# EAGLE design light_up_board (EAGLE 6.6.0)
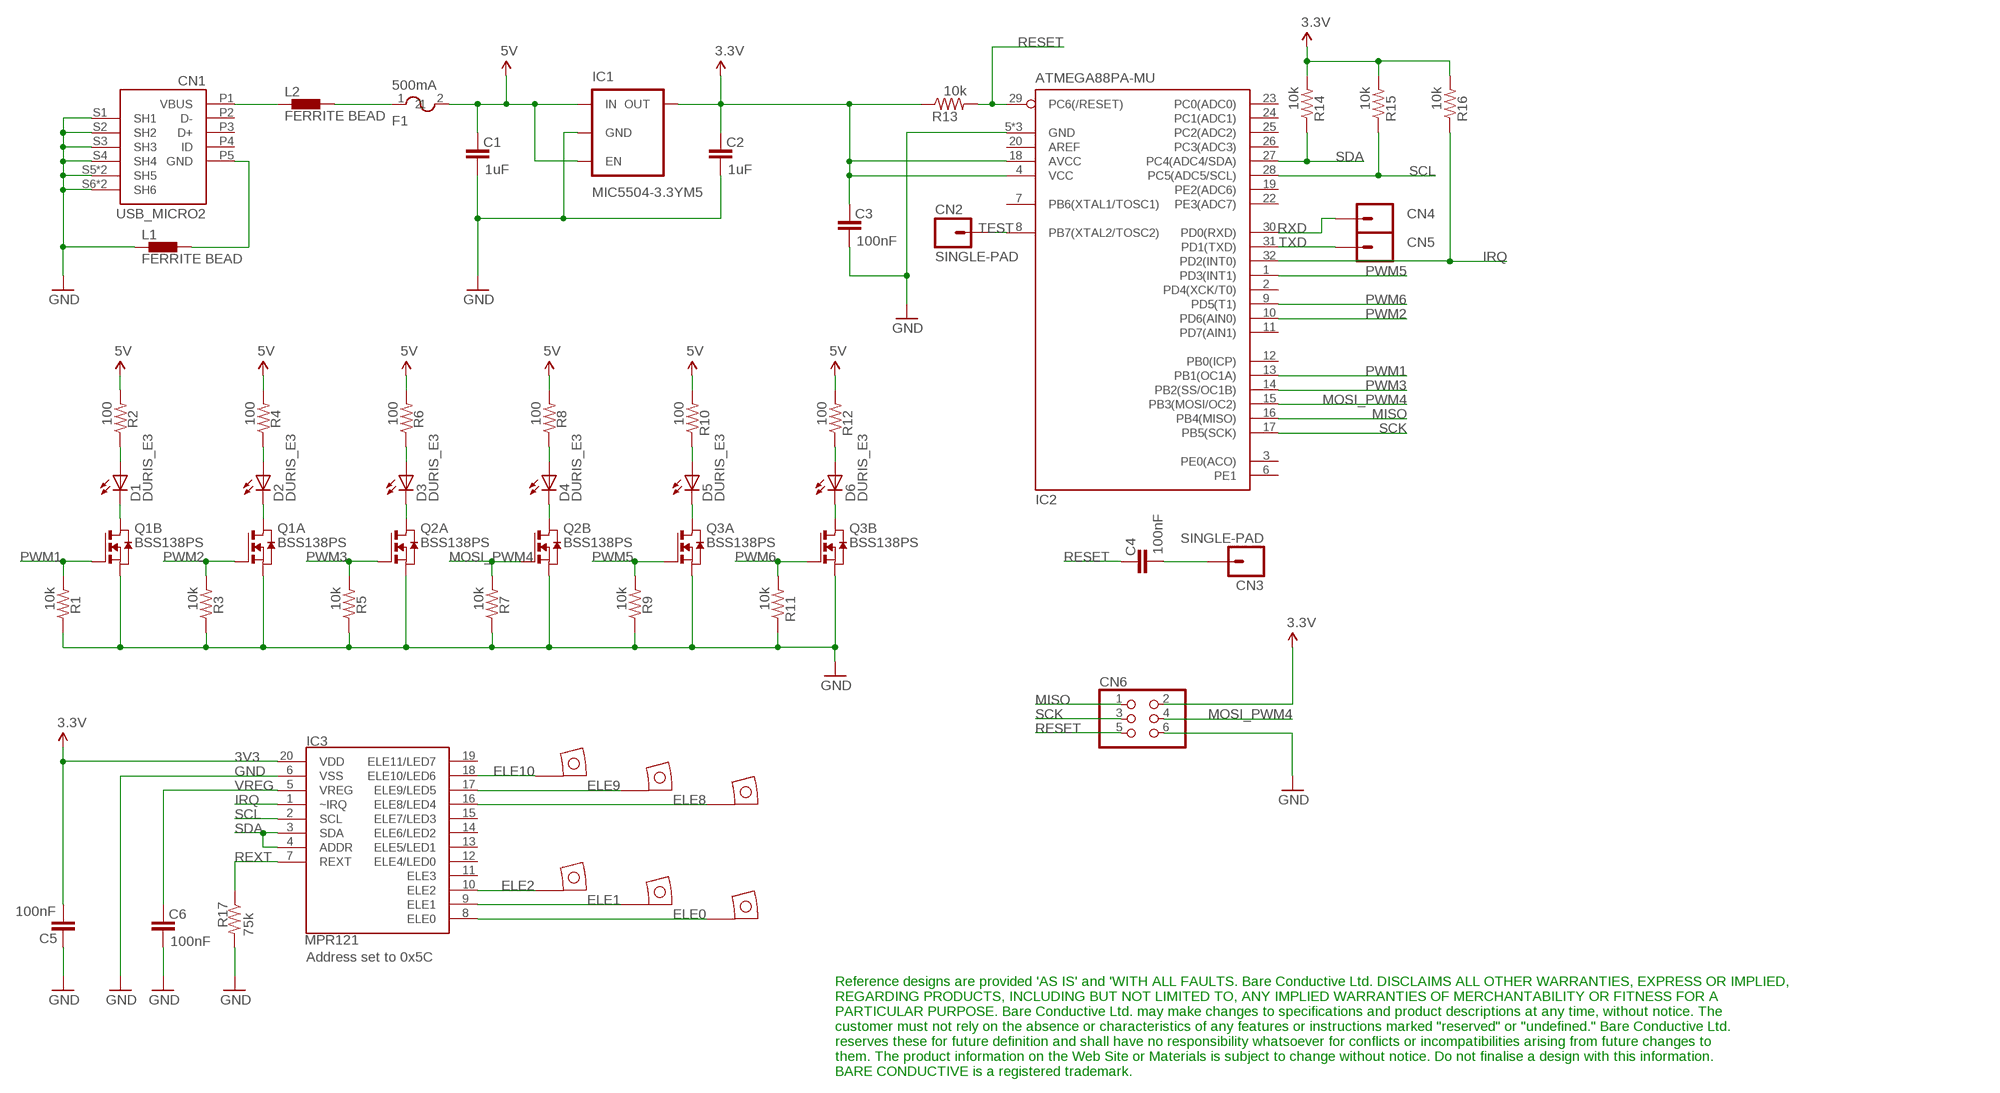
[diagram p0: schematic, sheet 1]

## Parts
C1  1uF  CAP0402-CAP  [0402-CAP]
C2  1uF  CAP0402-CAP  [0402-CAP]
C3  100nF  CAP0402-CAP  [0402-CAP]
C4  100nF  CAP0402-CAP  [0402-CAP]
C5  100nF  CAP0402-CAP  [0402-CAP]
C6  100nF  CAP0402-CAP  [0402-CAP]
CN1  USB_MICRO2  [USB_MICRO_B_SCK_2_TANGS]
CN2  SINGLE-PAD  [1MM_0.4MM_DRILL_PAD]
CN3  SINGLE-PAD  [1MM_0.4MM_DRILL_PAD]
CN4  SINGLE-PAD  [1MM_0.4MM_DRILL_PAD]
CN5  SINGLE-PAD  [1MM_0.4MM_DRILL_PAD]
CN6  ICSP  PINHD-2X3SQ1_1.27_0.4_DRILL  [2X03_1.27_SQ1_0.4_DRILL]
D1  DURIS_E3  [PLCC2_3X1.4]
D2  DURIS_E3  [PLCC2_3X1.4]
D3  DURIS_E3  [PLCC2_3X1.4]
D4  DURIS_E3  [PLCC2_3X1.4]
D5  DURIS_E3  [PLCC2_3X1.4]
D6  DURIS_E3  [PLCC2_3X1.4]
F1  500mA  PTC  [MF-PSMF050X-2]
IC1  MIC5504-3.3YM5  V_REG_LDOSMD  [SOT23-5]
IC2  ATMEGA88PA-MU  MEGAX8PBMU/MEDPADS  [HVQFN32-MEDPADS]
IC3  MPR121  MPR121QR2/LONGPADS-NORESIST  [QFN-20-0.4MM-LONGPADS-NORESIST]
L1  FERRITE BEAD  BLM15HB121SN1  [0402]
L2  FERRITE BEAD  BLM15HB121SN1  [0402]
Q1  BSS138PS  [SOT363_PHILIPS]
Q2  BSS138PS  [SOT363_PHILIPS]
Q3  BSS138PS  [SOT363_PHILIPS]
R1  10k  RESISTOR0402-RES  [0402-RES]
R2  100  RESISTOR0402-RES  [0402-RES]
R3  10k  RESISTOR0402-RES  [0402-RES]
R4  100  RESISTOR0402-RES  [0402-RES]
R5  10k  RESISTOR0402-RES  [0402-RES]
R6  100  RESISTOR0402-RES  [0402-RES]
R7  10k  RESISTOR0402-RES  [0402-RES]
R8  100  RESISTOR0402-RES  [0402-RES]
R9  10k  RESISTOR0402-RES  [0402-RES]
R10  100  RESISTOR0402-RES  [0402-RES]
R11  10k  RESISTOR0402-RES  [0402-RES]
R12  100  RESISTOR0402-RES  [0402-RES]
R13  10k  RESISTOR0402-RES  [0402-RES]
R14  10k  RESISTOR0402-RES  [0402-RES]
R15  10k  RESISTOR0402-RES  [0402-RES]
R16  10k  RESISTOR0402-RES  [0402-RES]
R17  75k  RESISTOR0402-RES  [0402-RES]
U$1  EPSK-ELEC_2.0  [EPSK_ELEC_2.0]
U$2  EPSK-ELEC_2.0  [EPSK_ELEC_2.0]
U$3  EPSK-ELEC_2.0  [EPSK_ELEC_2.0]
U$4  EPSK-ELEC_2.0  [EPSK_ELEC_2.0]
U$5  EPSK-ELEC_2.0  [EPSK_ELEC_2.0]
U$6  EPSK-ELEC_2.0  [EPSK_ELEC_2.0]

## Nets
3V3: C2.2 C3.2 C5.1 CN6.2 IC1.5(OUT) IC2.4(VCC) IC2.18(AVCC) IC3.20(VDD) R13.1 R14.2 R15.2 R16.2 ; supply symbol labelled 3.3V
5V: C1.2 F1.2 IC1.1(IN) IC1.3(EN) R2.2 R4.2 R6.2 R8.2 R10.2 R12.2
ELE0: IC3.8(ELE0) U$6.1
ELE1: IC3.9(ELE1) U$4.1
ELE2: IC3.10(ELE2) U$2.1
ELE8: IC3.16(ELE8/LED4) U$5.1
ELE9: IC3.17(ELE9/LED5) U$3.1
ELE10: IC3.18(ELE10/LED6) U$1.1
GND: C1.1 C2.1 C3.1 C5.2 C6.1 CN1.S1(SH1) CN1.S2(SH2) CN1.S3(SH3) CN1.S4(SH4) CN1.S5(SH5) CN1.S6(SH6) CN1.S7(SH5) CN1.S8(SH6) CN6.6 IC1.2(GND) IC2.5(GND) IC2.21(GND) IC2.EXP(GND) IC3.6(VSS) L1.1 Q1.1(A:S) Q1.4(B:S) Q2.1(A:S) Q2.4(B:S) Q3.1(A:S) Q3.4(B:S) R1.1 R3.1 R5.1 R7.1 R9.1 R11.1 R17.2
IRQ: IC2.32(PD2(INT0)) IC3.1(~IRQ) R16.1
MISO: CN6.1 IC2.16(PB4(MISO))
MOSI_PWM4: CN6.4 IC2.15(PB3(MOSI/OC2)) Q2.5(B:G) R7.2
N$1: D4.A R8.1
N$2: CN1.P1(VBUS) L2.1
N$3: D1.K(C) Q1.3(B:D)
N$4: CN1.P5(GND) L1.2
N$5: F1.1 L2.2
N$6: C4.1 CN3.1
N$7: D1.A R2.1
N$8: D5.A R10.1
N$9: D6.A R12.1
N$10: D2.K(C) Q1.6(A:D)
N$11: D2.A R4.1
N$12: D3.A R6.1
N$13: D3.K(C) Q2.6(A:D)
N$14: D4.K(C) Q2.3(B:D)
N$15: D5.K(C) Q3.6(A:D)
N$16: D6.K(C) Q3.3(B:D)
PWM1: IC2.13(PB1(OC1A)) Q1.5(B:G) R1.2
PWM2: IC2.10(PD6(AIN0)) Q1.2(A:G) R3.2
PWM3: IC2.14(PB2(SS/OC1B)) Q2.2(A:G) R5.2
PWM5: IC2.1(PD3(INT1)) Q3.2(A:G) R9.2
PWM6: IC2.9(PD5(T1)) Q3.5(B:G) R11.2
RESET: C4.2 CN6.5 IC2.29(PC6(/RESET)) R13.2
REXT: IC3.7(REXT) R17.1
RXD: CN4.1 IC2.30(PD0(RXD))
SCK: CN6.3 IC2.17(PB5(SCK))
SCL: IC2.28(PC5(ADC5/SCL)) IC3.2(SCL) R15.1
SDA: IC2.27(PC4(ADC4/SDA)) IC3.3(SDA) IC3.4(ADDR) R14.1
TEST: CN2.1 IC2.8(PB7(XTAL2/TOSC2))
TXD: CN5.1 IC2.31(PD1(TXD))
VREG: C6.2 IC3.5(VREG)
Unconnected: CN1.P2(D-) CN1.P3(D+) CN1.P4(ID) IC2.2(PD4(XCK/T0)) IC2.3(PE0(ACO)) IC2.6(PE1) IC2.7(PB6(XTAL1/TOSC1)) IC2.11(PD7(AIN1)) IC2.12(PB0(ICP)) IC2.19(PE2(ADC6)) IC2.20(AREF) IC2.22(PE3(ADC7)) IC2.23(PC0(ADC0)) IC2.24(PC1(ADC1)) IC2.25(PC2(ADC2)) IC2.26(PC3(ADC3)) IC3.11(ELE3) IC3.12(ELE4/LED0) IC3.13(ELE5/LED1) IC3.14(ELE6/LED2) IC3.15(ELE7/LED3) IC3.19(ELE11/LED7)

## Notes on the sheet
- Address set to 0x5C
- Reference designs are provided 'AS IS' and 'WITH ALL FAULTS. Bare Conductive Ltd. DISCLAIMS ALL OTHER WARRANTIES, EXPRESS OR IMPLIED,
  REGARDING PRODUCTS, INCLUDING BUT NOT LIMITED TO, ANY IMPLIED WARRANTIES OF MERCHANTABILITY OR FITNESS FOR A 
  PARTICULAR PURPOSE. Bare Conductive Ltd. may make changes to specifications and product descriptions at any time, without notice. The 
  customer must not rely on the absence or characteristics of any features or instructions marked "reserved" or "undefined." Bare Conductive Ltd.
  reserves these for future definition and shall have no responsibility whatsoever for conflicts or incompatibilities arising from future changes to 
  them. The product information on the Web Site or Materials is subject to change without notice. Do not finalise a design with this information.
  BARE CONDUCTIVE is a registered trademark.

## Library data of the parts
C1-C6 = SparkFun:CAP: Capacitor Standard 0603 ceramic capacitor, and 0.1" leaded capacitor.
CN1 = BC-Connectors:USB_MICRO
CN2-CN5 = BC-Connectors:SINGLE-PAD
CN6 = BC-Connectors:PINHD-2X3: PIN HEADER
D1-D6 = BC-LED:DURIS_E3
F1 = BareConductive:PTC: PTC FUSE 0805
IC1 = BC-AnalogIC:V_REG_LDO: Voltage Regulator LDO Standard 300mA LDO voltage regulator in SOT-23 layout. Microchip (Micrel) part MIC5501/2/3/4.
IC2 = BC-DigitalIC:MEGAX8PB: MICROCONTROLLER 8 Kbytes FLASH, 1 kbytes SRAM, 512 bytes EEPROM, USART, 6-channel 10 bit ADC, 2-channel 8 bit ADC Pin compatible with Atmega48PB, ATMega88PB, ATMega168PB, ATMega328PB
IC3 = BC-Sensors:MPR121QR2
L1 L2 = inductors:BLM15H: EMIFIL (R) Chip Ferrite Bead for GHz Noise Source: http://www.murata.com/ Ferrite Bead BLM15H.pdf
Q1-Q3 = BC-DiscreteSemi:BSS138PS: Dual MOS FET
R1-R17 = SparkFun:RESISTOR: Resistor Basic schematic elements and footprints for 0603, 1206, and PTH resistors.
U$1-U$6 = BC-Connectors:EPSK-ELEC

## Net classes
2 gnd: width 0.2 mm, drill 0.5 mm, clearance 0.2 mm
3 usbvcc: width 0.2 mm, drill 0.5 mm, clearance 0.2 mm

## Board
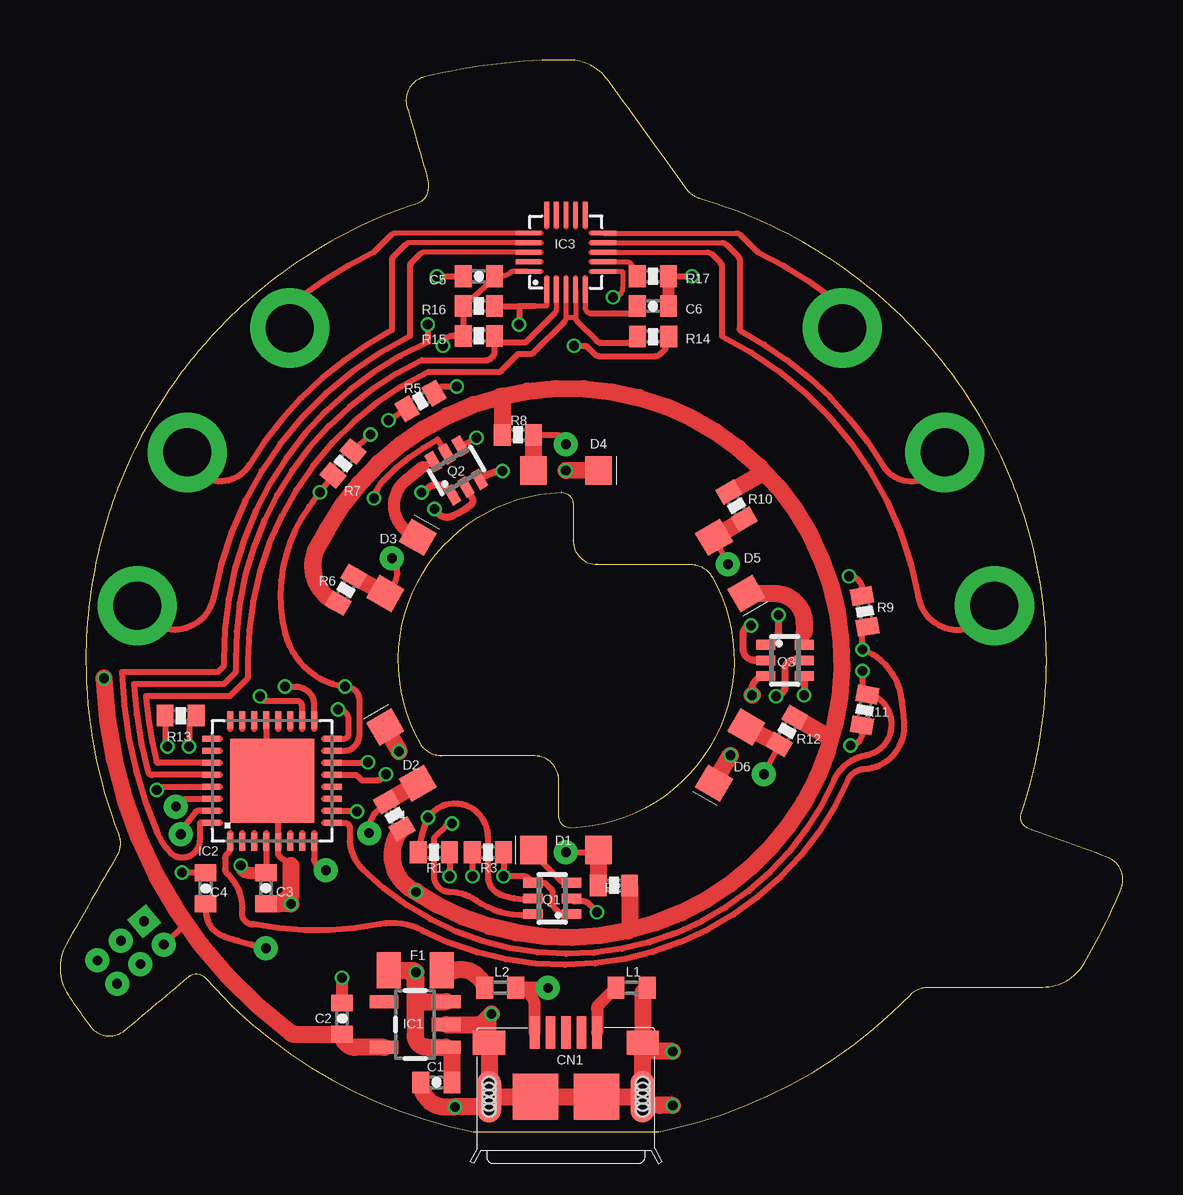
[diagram p1: board, top side]
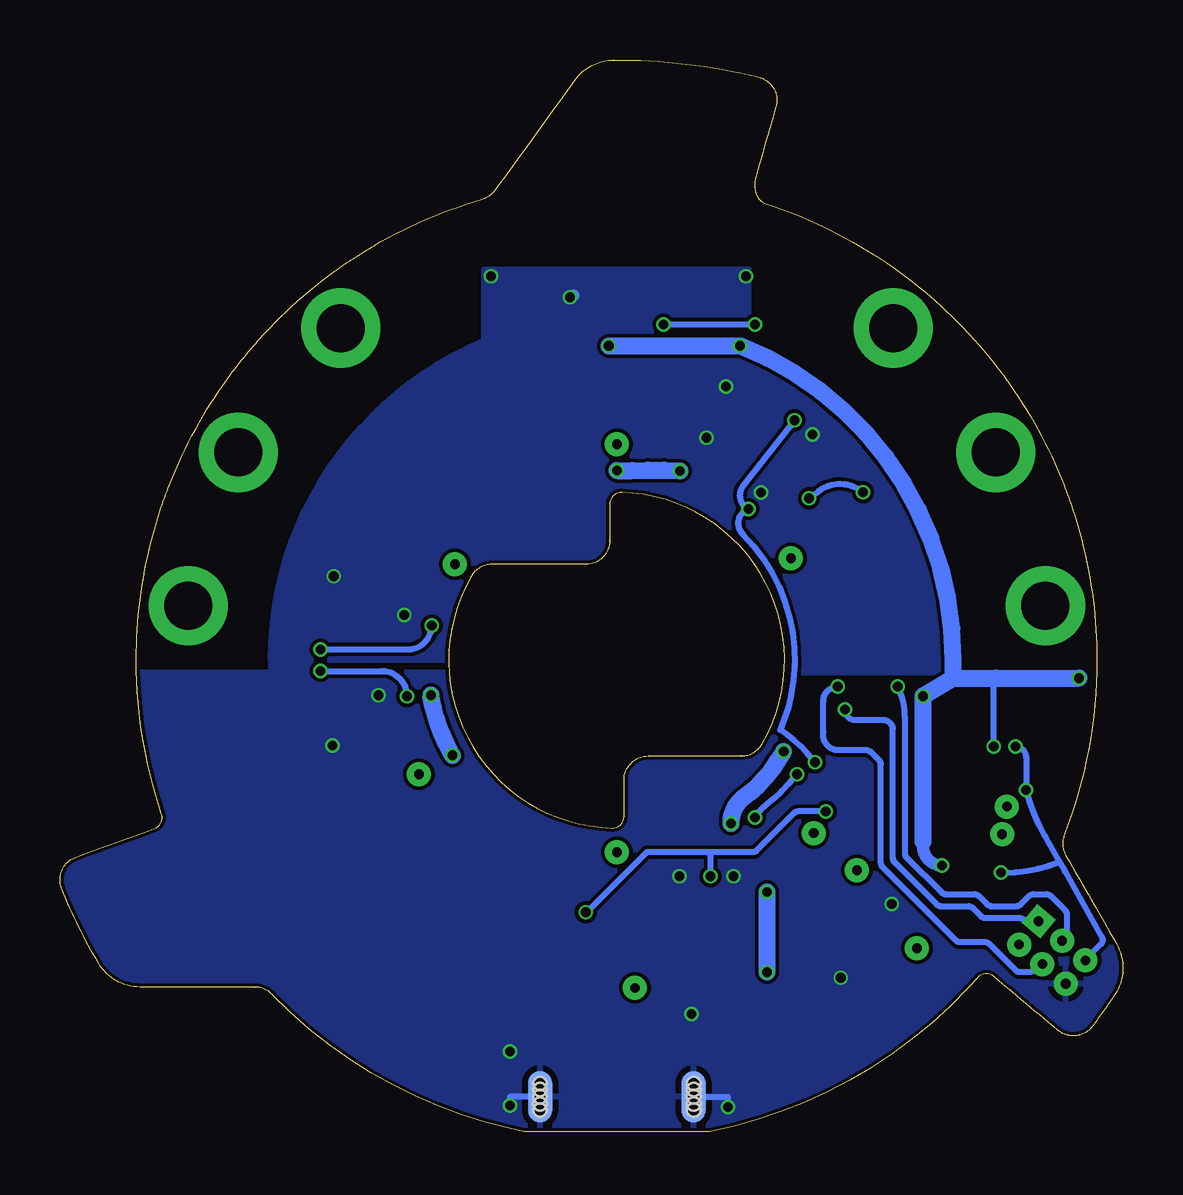
[diagram p2: board, bottom side, seen from below]

Size 44.28 x 44.65 mm. Coordinates in mm from the lower left corner, seen from the top.
Outline: 15.9,15.65 19.78,15.65 19.88,15.64 19.98,15.63 20.08,15.6 20.17,15.57 20.26,15.53 20.34,15.48 20.42,15.42 20.49,15.35 20.56,15.28 20.61,15.2 20.66,15.12 20.71,15.03 20.74,14.94 20.76,14.85 20.78,14.75 20.78,14.64 20.78,13.14 20.78,13.14 20.79,13.04 20.82,12.95 20.87,12.86 20.93,12.79 21,12.73 21.09,12.68 21.18,12.65 21.28,12.64 21.74,12.67 22.2,12.73 22.66,12.82 23.11,12.94 23.55,13.09 23.98,13.26 24.39,13.47 24.79,13.7 25.17,13.96 25.54,14.24 25.89,14.55 26.22,14.88 26.53,15.23 26.81,15.61 27.07,16.01 27.3,16.42 27.51,16.85 27.68,17.28 27.82,17.73 27.93,18.18 28.02,18.64 28.07,19.09 28.09,19.56 28.08,20.02 28.04,20.48 27.97,20.94 27.86,21.39 27.73,21.84 27.57,22.28 27.38,22.71 27.15,23.13 27.16,23.12 27.12,23.18 27.09,23.24 27.04,23.29 27,23.33 26.95,23.38 26.9,23.42 26.85,23.46 26.79,23.49 26.73,23.52 26.67,23.55 26.61,23.57 26.55,23.59 26.49,23.61 26.42,23.62 26.36,23.63 26.29,23.63 22.38,23.63
Outline: 15.87,15.65 15.9,15.65
Outline: 15.9,15.65 15.83,15.65 15.76,15.66 15.7,15.67 15.63,15.68 15.57,15.7 15.51,15.73 15.45,15.75 15.39,15.78 15.34,15.82 15.29,15.86 15.24,15.9 15.19,15.94 15.14,15.99 15.1,16.04 15.06,16.09 15.03,16.15 15.03,16.15 14.81,16.57 14.61,17 14.45,17.44 14.32,17.89 14.22,18.34 14.15,18.8 14.11,19.26 14.1,19.72 14.12,20.18 14.17,20.64 14.25,21.1 14.36,21.55 14.5,21.99 14.68,22.43 14.88,22.85 15.11,23.27 15.37,23.67 15.66,24.04 15.97,24.4 16.29,24.73 16.64,25.04 17.01,25.32 17.39,25.58 17.79,25.81 18.21,26.01 18.63,26.19 19.07,26.34 19.52,26.46 19.98,26.54 20.44,26.6 20.92,26.63 20.88,26.63 20.98,26.62 21.07,26.59 21.16,26.55 21.23,26.49 21.29,26.41 21.34,26.33 21.37,26.23 21.38,26.13 21.38,26.01 21.38,24.63
Outline: 21.38,24.62 21.38,24.63
Outline: 21.38,24.63 21.38,24.53 21.4,24.43 21.42,24.33 21.46,24.24 21.5,24.15 21.55,24.07 21.61,23.99 21.67,23.92 21.74,23.86 21.82,23.8 21.9,23.75 21.99,23.71 22.08,23.67 22.18,23.65 22.28,23.63 22.38,23.63
Outline: 22.38,23.63 22.37,23.63
Outline: 36.16,6.02 36.11,6.02 36.06,6.01 36.01,6.01 35.96,6 35.91,5.99 35.86,5.97 35.82,5.96 35.77,5.94 35.73,5.92 35.68,5.89 35.64,5.87 35.6,5.84 35.55,5.81 35.51,5.78 35.48,5.75 35.44,5.71 35.44,5.71 34.68,4.97 33.89,4.27 33.07,3.62 32.22,3.01 31.33,2.46 30.43,1.95 29.5,1.48 28.54,1.07 27.57,0.71 26.58,0.4 25.57,0.14 24.95,0 17.22,0 16.19,0.23 15.19,0.51 14.2,0.84 13.24,1.22 12.29,1.65 11.37,2.13 10.47,2.66 9.6,3.24 8.76,3.86 7.96,4.52 7.18,5.23 6.44,5.98 6.07,6.4 6,6.47 5.91,6.52 5.82,6.55 5.73,6.57 5.63,6.56 5.54,6.54 5.45,6.5 5.37,6.45 5.38,6.46 5.19,6.3 4.99,6.14 4.8,5.98 4.61,5.82 4.42,5.66 4.23,5.5 4.04,5.34 3.85,5.18 3.66,5.02 3.47,4.86 3.28,4.7 3.09,4.54 2.9,4.38 2.71,4.22 2.71,4.22 2.67,4.19 2.63,4.16 2.59,4.13 2.54,4.11 2.5,4.08 2.45,4.06 2.4,4.04 2.36,4.03 2.31,4.02 2.26,4 2.21,4 2.16,3.99 2.11,3.99 2.06,3.99 2.01,3.99 1.95,3.99 1.9,4 1.85,4.01 1.8,4.02 1.76,4.03 1.71,4.05 1.66,4.07 1.62,4.09 1.57,4.11 1.53,4.14 1.49,4.17 1.45,4.2 1.41,4.23 1.37,4.26 1.33,4.3 1.3,4.34 1.27,4.38 1.28,4.38 1.22,4.46 1.16,4.54 1.1,4.62 1.04,4.7 0.98,4.78 0.92,4.86 0.86,4.94 0.8,5.03 0.74,5.11 0.68,5.19 0.62,5.27 0.56,5.36 0.51,5.44 0.45,5.52 0.39,5.61 0.33,5.69 0.34,5.7 0.26,5.82 0.2,5.94 0.14,6.07 0.09,6.2 0.06,6.33 0.03,6.47 0.01,6.61 0,6.74 0,6.88 0.01,7.02 0.03,7.16 0.06,7.29 0.1,7.42 0.14,7.56 0.2,7.69 0.25,7.8 0.39,8.03 0.52,8.26 0.65,8.49 0.78,8.72 1.18,9.42 1.31,9.65 1.44,9.88 1.71,10.34 1.84,10.57 1.97,10.8 2.11,11.04 2.24,11.27 2.37,11.5 2.4,11.55 2.42,11.6 2.44,11.65 2.46,11.71 2.48,11.76 2.49,11.82 2.5,11.87 2.5,11.93 2.5,11.98 2.5,12.04 2.5,12.09 2.49,12.15 2.48,12.21 2.47,12.26 2.45,12.31 2.45,12.35 2.29,12.79 2.13,13.23 1.99,13.68 1.85,14.12 1.73,14.57 1.62,15.02 1.52,15.48 1.42,15.93 1.34,16.39 1.27,16.85 1.21,17.31 1.17,17.78 1.13,18.24 1.1,18.7 1.08,19.17 1.08,19.64 1.08,19.95 1.09,20.27 1.1,20.59 1.12,20.9 1.14,21.22 1.17,21.54 1.2,21.85 1.24,22.16 1.28,22.48 1.33,22.79 1.38,23.1 1.44,23.41 1.5,23.72 1.57,24.03 1.64,24.34 1.72,24.65 1.75,24.8 1.79,24.95 1.84,25.09 1.88,25.24 1.92,25.39 1.97,25.53 2.01,25.68 2.06,25.82 2.11,25.97 2.15,26.11 2.2,26.26 2.26,26.4 2.31,26.54 2.36,26.69 2.42,26.83 2.47,26.97 2.59,27.27 2.71,27.56 2.84,27.85 2.97,28.14 3.11,28.42 3.25,28.71 3.4,28.99 3.55,29.26 3.7,29.54 3.86,29.81 4.02,30.09 4.19,30.35 4.36,30.62 4.54,30.88 4.72,31.14 4.9,31.4 4.99,31.53 5.08,31.65 5.18,31.77 5.27,31.89 5.36,32.01 5.46,32.13 5.55,32.25 5.65,32.37 5.75,32.49 5.85,32.6 5.95,32.72 6.05,32.83 6.15,32.95 6.25,33.06 6.35,33.17 6.46,33.29 6.67,33.52 6.89,33.74 7.12,33.97 7.35,34.19 7.58,34.4 7.82,34.61 8.05,34.82 8.3,35.03 8.54,35.23 8.79,35.42 9.04,35.61 9.29,35.8 9.55,35.99 9.81,36.17 10.07,36.34 10.34,36.52 10.34,36.52 10.64,36.71 10.95,36.89 11.27,37.07 11.58,37.25 11.9,37.41 12.22,37.58 12.54,37.73 12.87,37.88 13.2,38.03 13.53,38.17 13.87,38.3 14.2,38.43 14.54,38.55 14.89,38.66 15.07,38.76 15.2,38.88 15.28,39.03 15.33,39.2 15.34,39.37 15.33,39.54 15.31,39.69 15.28,39.83 15.21,40.07 15.14,40.3 15.08,40.54 15.01,40.78 14.94,41.02 14.87,41.26 14.8,41.5 14.73,41.74 14.59,42.22 14.52,42.46 14.46,42.7 14.46,42.69 14.44,42.74 14.43,42.79 14.42,42.84 14.42,42.89 14.42,42.94 14.42,42.99 14.42,43.04 14.42,43.09 14.43,43.14 14.44,43.19 14.45,43.24 14.47,43.29 14.49,43.33 14.51,43.38 14.53,43.43 14.56,43.47 14.58,43.52 14.61,43.56 14.64,43.6 14.68,43.64 14.71,43.67 14.75,43.71 14.79,43.74 14.83,43.77 14.87,43.8 14.92,43.83 14.96,43.85 15.01,43.88 15.06,43.9 15.11,43.92 15.16,43.93 15.21,43.94 15.58,44.03 15.95,44.11 16.32,44.19 16.69,44.26 17.07,44.32 17.44,44.38 17.82,44.43 18.19,44.48 18.57,44.52 18.95,44.55 19.33,44.58 19.71,44.61 20.09,44.63 20.47,44.64 20.85,44.65 21.23,44.65 21.21,44.65 21.33,44.64 21.45,44.63 21.56,44.61 21.68,44.59 21.79,44.56 21.9,44.52 22.01,44.48 22.11,44.43 22.21,44.37 22.31,44.31 22.41,44.24 22.5,44.17 22.58,44.09 22.67,44.01 22.74,43.92 22.82,43.82
Outline: 36.16,6.02 36.15,6.02
Outline: 36.16,6.02 40.95,6.02 41.08,6.02 41.21,6.03 41.34,6.06 41.46,6.09 41.59,6.12 41.71,6.17 41.83,6.22 41.94,6.28 42.05,6.35 42.16,6.42 42.26,6.51 42.35,6.59 42.44,6.69 42.52,6.79 42.6,6.9 42.67,7.01 42.68,7.01 42.78,7.19 42.89,7.38 43,7.57 43.1,7.76 43.2,7.95 43.3,8.15 43.4,8.34 43.5,8.53 43.59,8.73 43.69,8.92 43.78,9.12 43.87,9.32 43.96,9.52 44.05,9.71 44.13,9.91 44.22,10.11 44.21,10.11 44.23,10.16 44.24,10.2 44.26,10.25 44.27,10.3 44.28,10.35 44.28,10.4 44.28,10.45 44.29,10.5 44.28,10.55 44.28,10.6 44.27,10.65 44.26,10.7 44.25,10.75 44.24,10.8 44.22,10.85 44.2,10.9 44.18,10.94 44.15,10.99 44.13,11.03 44.1,11.07 44.07,11.11 44.04,11.15 44,11.19 43.97,11.23 43.93,11.26 43.89,11.29 43.85,11.32 43.81,11.35 43.76,11.37 43.72,11.4 43.67,11.42 43.62,11.44 43.39,11.52 43.16,11.61 42.92,11.69 42.69,11.77 42.45,11.86 42.22,11.94 41.98,12.03 41.75,12.11 41.52,12.2 41.28,12.28 41.05,12.37 40.81,12.45 40.58,12.54 40.37,12.61 40.28,12.65 40.2,12.71 40.13,12.78 40.08,12.86 40.05,12.95 40.03,13.05 40.03,13.15 40.06,13.25 40.18,13.62 40.31,14.04 40.42,14.46 40.53,14.88 40.63,15.31 40.72,15.73 40.8,16.16 40.87,16.59 40.93,17.02 40.99,17.46 41.03,17.89 41.06,18.33 41.09,18.76 41.1,19.2 41.1,19.64 41.1,19.95 41.09,20.27 41.08,20.59 41.06,20.9 41.04,21.22 41.01,21.54 40.98,21.85 40.94,22.16 40.9,22.48 40.86,22.79 40.8,23.1 40.75,23.41 40.68,23.72 40.62,24.03 40.54,24.34 40.47,24.65 40.43,24.8 40.39,24.94 40.35,25.09 40.31,25.24 40.26,25.39 40.22,25.53 40.17,25.68 40.13,25.82 40.08,25.97 40.03,26.11 39.98,26.26 39.93,26.4 39.88,26.54 39.82,26.69 39.77,26.83 39.71,26.97 39.59,27.27 39.47,27.56 39.34,27.85 39.21,28.14 39.07,28.42 38.93,28.71 38.79,28.99 38.64,29.26 38.48,29.54 38.32,29.81 38.16,30.09 37.99,30.35 37.82,30.62 37.65,30.88 37.47,31.14 37.28,31.4 37.19,31.53 37.1,31.65 37.01,31.77 36.92,31.89 36.82,32.01 36.73,32.13 36.63,32.25 36.53,32.37 36.44,32.49 36.34,32.6 36.24,32.72 36.14,32.83 36.04,32.95 35.93,33.06 35.83,33.17 35.73,33.29 35.51,33.52 35.29,33.74 35.06,33.97 34.84,34.19 34.6,34.4 34.37,34.61 34.13,34.82 33.89,35.03 33.64,35.23 33.4,35.42 33.14,35.61 32.89,35.8 32.63,35.99 32.37,36.17 32.11,36.34 31.84,36.52 31.54,36.7 31.24,36.89 30.93,37.06 30.63,37.23 30.31,37.4 30,37.56 29.68,37.71 29.36,37.86 29.04,38.01 28.71,38.14 28.38,38.28 28.05,38.4 27.72,38.52 27.39,38.64 27.05,38.74 26.71,38.85 26.67,38.87 26.63,38.88 26.59,38.9 26.55,38.91 26.51,38.93 26.48,38.95 26.44,38.97 26.41,38.99 26.37,39.01 26.34,39.03 26.31,39.06 26.28,39.09 26.24,39.11 26.22,39.14 26.19,39.17 26.16,39.21 25.95,39.5 25.74,39.78 25.53,40.07 25.33,40.36 25.12,40.65 24.91,40.94 24.7,41.23 24.49,41.51 24.28,41.8 24.07,42.09 23.86,42.38 23.65,42.67 23.44,42.96 23.23,43.24 23.03,43.53 22.82,43.82
Outline: 22.82,43.82 22.82,43.82
Copper layers (1*16): Top 0.035mm / dielectric 1.5mm / Bottom 0.035mm
Design rules "default *": minimum track width 0.2mm, minimum drill 0.4mm, track to track 6mil, track to pad 6mil, pad to pad 6mil, via to via 6mil, smd to smd 6mil, copper to edge 6mil, drill to drill 6mil, minimum pad ring 0mil, minimum via ring 0mil, stop-mask expansion 4mil, vias tented up to drill 0mil, thermal gap 10mil

### Footprints (pad centres in the part's own frame; a part is rotated, then mirrored left to right if it is on the bottom)
0402-CAP = smd 0.7 x 0.9: 1 -0.65,0; 2 0.65,0
USB_MICRO_B_SCK_2_TANGS = smd 0.4 x 1.35: P1 -1.3,0; P2 -0.65,0; P3 0,0; P4 0.65,0; P5 1.3,0 | smd 1.35 x 1: S1 -3.2,-0.425; S2 3.2,-0.425 | smd 1 x 2.15: S3 -3.2,-2.675; S6 3.2,-2.675 | smd 1.9 x 1.9: S4 -1.27,-2.675; S5 1.27,-2.675 | smd 1 x 2.15 bottom: S7 -3.2,-2.675; S8 3.2,-2.675 | hole 0.55: -3.2,-2.675; 3.2,-2.675; -3.2,-2.125; -3.2,-3.225; 3.2,-2.125; 3.2,-3.225; -3.2,-2.375; -3.2,-2.975; 3.2,-2.375; 3.2,-2.975
1MM_0.4MM_DRILL_PAD = drill 0.4 pad 1: 1 0,0
2X03_1.27_SQ1_0.4_DRILL = drill 0.4 pad 1 square: 1 -1.27,-0.635 | drill 0.4 pad 1: 2 -1.27,0.635; 3 0,-0.635; 4 0,0.635; 5 1.27,-0.635; 6 1.27,0.635
PLCC2_3X1.4 = smd 1.1 x 1.2: A -1.35,0; K 1.35,0
MF-PSMF050X-2 = smd 1 x 1.5: 1 -1.1,0; 2 1.1,0
SOT23-5 = smd 0.55 x 1.2: 1 -0.95,-1.3; 2 0,-1.3; 3 0.95,-1.3; 4 0.95,1.3; 5 -0.95,1.3
HVQFN32-MEDPADS = smd 0.725 x 0.25: 1 -2.538,1.75; 2 -2.538,1.25; 3 -2.538,0.75; 4 -2.538,0.25; 5 -2.538,-0.25; 6 -2.538,-0.75; 7 -2.538,-1.25; 8 -2.538,-1.75; 17 2.538,-1.75; 18 2.538,-1.25; 19 2.538,-0.75; 20 2.538,-0.25; 21 2.538,0.25; 22 2.538,0.75; 23 2.538,1.25; 24 2.538,1.75 | smd 0.25 x 0.725: 9 -1.75,-2.538; 10 -1.25,-2.538; 11 -0.75,-2.538; 12 -0.25,-2.538; 13 0.25,-2.538; 14 0.75,-2.538; 15 1.25,-2.538; 16 1.75,-2.538; 25 1.75,2.538; 26 1.25,2.538; 27 0.75,2.538; 28 0.25,2.538; 29 -0.25,2.538; 30 -0.75,2.538; 31 -1.25,2.538; 32 -1.75,2.538 | smd 3.5 x 3.5: EXP 0,0
QFN-20-0.4MM-LONGPADS-NORESIST = smd 1.05 x 0.2: 1 -1.575,0.8; 2 -1.575,0.4; 3 -1.575,0; 4 -1.575,-0.4; 5 -1.575,-0.8; 11 1.575,-0.8; 12 1.575,-0.4; 13 1.575,0; 14 1.575,0.4; 15 1.575,0.8 | smd 0.2 x 1.05: 6 -0.8,-1.575; 7 -0.4,-1.575; 8 0,-1.575; 9 0.4,-1.575; 10 0.8,-1.575; 16 0.8,1.575; 17 0.4,1.575; 18 0,1.575; 19 -0.4,1.575; 20 -0.8,1.575
0402 = smd 0.7 x 0.9: 1 -0.65,0; 2 0.65,0
SOT363_PHILIPS = smd 0.4 x 0.8: 1 -0.65,-0.8; 2 0,-0.8; 3 0.65,-0.8; 4 0.65,0.8; 5 0,0.8; 6 -0.65,0.8
0402-RES = smd 0.7 x 0.9: 1 -0.65,0; 2 0.65,0
EPSK_ELEC_2.0 = drill 2 pad 3.3: 1 0,0

### Placement (x,y rotation side)
C1  15.69,2.05 0 top
C2  11.75,4.7 270 top
C3  8.58,10.14 90 top
C4  6.07,10.13 90 top
C5  17.45,35.64 180 top
C6  24.71,34.4 180 top
CN1  21.08,4.12 0 top
CN2  11.08,10.89 0 top
CN3  8.58,7.64 0 top
CN4  4.83,13.54 0 top
CN5  5.03,12.39 0 top
CN6  2.94,7.46 220 top
D1  21.08,11.73 180 top
D2  14.23,15.69 120 top
D3  14.23,23.59 60 top
D4  21.08,27.54 0 top
D5  27.93,23.59 300 top
D6  27.93,15.69 240 top
F1  14.8,6.72 180 top
IC1  14.8,4.46 90 top
IC2  8.83,14.61 90 top
IC3  21.08,36.64 90 top
L1  23.82,5.99 180 top
L2  18.34,5.99 180 top
Q1  20.51,9.71 90 top
Q2  16.52,27.54 30 top
Q3  30.21,19.63 270 top
R1  15.58,11.64 180 top
R2  23.08,10.25 0 top
R3  17.83,11.64 180 top
R4  13.92,13.18 300 top
R5  15.02,30.44 210 top
R6  11.92,22.57 240 top
R7  11.8,27.84 230 top
R8  19.08,29.03 180 top
R9  33.53,21.68 280 top
R10  28.19,26.08 120 top
R11  33.53,17.57 80 top
R12  30.29,16.69 60 top
R13  5.03,17.33 180 top
R14  24.71,33.12 0 top
R15  17.45,33.15 180 top
R16  17.45,34.4 180 top
R17  24.71,35.64 0 top
U$1  3.22,21.91 0 top
U$2  32.59,33.48 237.5 top
U$3  5.3,28.3 338.5 top
U$4  36.86,28.3 216 top
U$5  9.57,33.48 317 top
U$6  38.94,21.91 194.5 top

### Tracks (layer width: path | path; a pad name or v marks a point on that pad's centre or on a via)
3V3  (via drill 0.4)
  Top 0.2: 18.23,35.84 C5.1 18.5,35.66 arc46 18.75,35.79 arc-37 18.9,35.84 IC3.20
  Top 0.25: C5.1 arc45 18.13,35.6 R16.2 R15.2 16.37,33.15 arc90 v15.96,32.74 | v21.42,32.74 21.82,32.74 arc-45 22,32.67 22.29,32.38 arc45 22.46,32.31 24.82,32.31 arc45 25.05,32.43 25.23,32.61 25.23,33.11 arc-45 R14.2 | 8.59,10.8 arc-45 C3.2 | CN6.2 5.23,8.64 3.98,10.74 | 3.93,10.74 3.33,12.14 2.58,14.14 2.08,16.39 1.83,18.14 v1.83,18.89 | 8.59,10.65 arc-45 8.58,10.64 arc90 8.59,10.64 C3.2 | IC2.4 C3.2 | IC2.18 10.09,17.73 arc90 10.08,17.74 arc90 9.88,17.94 8.53,17.94 arc-90 v8.33,18.14 | R13.1 arc90 5.38,17.03 v5.38,16.04
  Top 0.406: 3.98,10.74 3.93,10.74
  Top 0.5: 11.8,4.01 arc-90 C2.2 | v7.53,11.09 arc90 7.83,10.79 C3.2
  Top 0.7: v1.83,18.89 arc51 9.53,4.19 9.59,4.13 arc45 9.77,4.05 C2.2 arc90 12.3,3.51 IC1.5
  Bottom 0.25: v5.38,16.04 5.38,18.79 arc90 5.28,18.89
  Bottom 0.5: 8.33,12.09 8.33,11.89 arc-90 v7.53,11.09
  Bottom 0.7: v21.42,32.74 v15.96,32.74 arc69 7.07,19.66 arc-90 7.08,19.65 7.08,18.89 | 7.08,18.89 5.28,18.89 v1.83,18.89 | 8.33,12.09 v8.33,18.14 7.08,18.89
5V  (via drill 0.4)
  Top 0.25: 16.16,5.47 14.83,5.39 v14.83,6.64 | 11.13,25.09 11.13,25.08 11.83,26.14 12.83,27.39 14.33,28.64 16.08,29.89 17.33,30.39 18.43,30.39 | 14.73,10.04 14.83,10.01 v14.83,9.99 15.83,9.39 16.33,9.14 17.58,8.64 18.83,8.39 20.33,8.14 21.58,8.14 23.33,8.39 23.63,8.39 | R10.2 29.33,27.39 30.08,26.89 30.58,26.14 31.08,25.14 31.58,23.89 32.08,22.89 32.33,22.14 32.58,20.39 32.58,18.39 32.33,17.39 31.88,16.54 | R8.2 18.33,30.64 19.58,30.89 22.83,30.89 24.08,30.64 25.33,30.14 26.83,29.39 27.58,28.89 28.58,28.14 29.08,27.32
  Top 0.3: 15.24,5.41 IC1.3 arc90 16.16,5.47 | 16.09,3.52 arc-90 IC1.1
  Top 0.7: R10.2 29.08,27.32 | R12.2 31.88,16.54 | 18.43,30.65 18.43,30.52 18.43,30.39 R8.2 | 11.13,25.08 arc-2 10.76,24.43 arc100 R6.2 | 15.24,5.41 arc90 14.8,4.97 14.8,4 arc90 15.28,3.52 16.09,3.52 | v14.83,9.99 arc-106 R4.2 | C1.2 16.34,3.27 IC1.1 | IC1.3 15.11,5.41 arc-45 14.93,5.48 14.9,5.51 arc-45 14.83,5.69 14.83,6.39 | F1.2 14.4,6.72 | 14.4,6.72 arc-45 14.58,6.64 14.83,6.39 | 14.79,4.46 arc45 14.81,4.49 14.81,6.38 14.81,6.38 arc45 14.83,6.39 | 14.4,6.72 14.65,6.72 arc-45 v14.83,6.64 | 14.83,10 14.83,10.01 | 11.13,25.09 arc-275 14.73,10.04 | R2.2 23.73,8.59 arc-45 23.66,8.42 23.63,8.39
  Bottom 0.7: v14.83,9.99 v14.83,6.64
ELE0
  Top 0.2: IC3.8 26.98,36.64 arc-45 27.15,36.56
  Top 0.25: 27.15,36.56 27.51,36.21 arc-45 27.58,36.03 27.58,33.14 arc-54 35.76,22.28 arc146 U$6.1
ELE1
  Top 0.2: IC3.9 27.58,37.04 arc-45 27.75,36.96
  Top 0.25: 27.75,36.96 28.26,36.46 arc-45 28.33,36.28 28.33,33.64 28.33,33.49 28.33,33.39 arc-31 34.28,27.77 arc141 U$4.1
ELE2
  Top 0.2: IC3.10 28.18,37.44 arc-45 28.35,37.36
  Top 0.25: 28.35,37.36 29.08,36.64 arc-15 33.1,33.98 arc-189 U$2.1
ELE8
  Top 0.2: IC3.16 13.98,37.44 arc45 13.81,37.36
  Top 0.25: 13.81,37.36 13.08,36.64 arc15 9.06,33.98 arc189 U$5.1
ELE9
  Top 0.2: IC3.17 14.58,37.04 arc45 14.41,36.96
  Top 0.25: 14.41,36.96 13.9,36.46 arc45 13.83,36.28 13.83,33.39 arc31 7.88,27.77 arc-141 U$3.1
ELE10
  Top 0.2: IC3.18 15.18,36.64 arc45 15.01,36.56
  Top 0.25: 15.01,36.56 14.65,36.21 arc45 14.58,36.03 14.58,33.14 arc54 6.4,22.28 arc-146 U$1.1
GND  (via drill 0.4)
  Top 0.2: IC3.6 23.45,35.84 23.45,35.15 arc-90 v23.03,34.76
  Top 0.25: R17.2 v26.33,35.64 | v15.7,35.64 C5.2 | Q2.4 v17.35,28.91 | v32.88,23.14 arc-90 33.43,22.58 R9.1 | R11.1 33.43,16.63 arc-90 v32.93,16.09 | R1.1 v16.23,10.64 | R3.1 v18.48,10.64 19.33,10.64 arc-45 19.51,10.56 Q1.4 20.1,10.36 arc-45 20.28,10.29 20.46,10.11 arc-45 20.53,9.93 20.53,9.49 arc45 20.6,9.31 20.78,9.14 arc45 20.96,9.06 Q1.1 | v16.53,31.04 15.96,31.04 arc45 15.78,30.96 R5.1 | R7.1 v12.93,29.04 | IC2.21 8.59,14.96 arc45 8.66,14.78 IC2.EXP 9.01,14.43 arc-45 9.09,14.25 IC2.5 arc-1 9.08,11.64 arc56 9.18,11.44 arc-5 9.63,11.09 | C3.1 9.08,9.49
  Top 0.254: CN1.S7 17.88,1.02 v16.45,1.02 | CN1.S8 24.28,1.09 v25.53,1.09
  Top 0.3: Q3.4 v31.01,18.18 arc90 v31.01,18.18 | Q3.1 arc90 29.94,20.82 v29.94,21.52 | v15.07,26.62 15.45,26.9 arc-88 Q2.1
  Top 0.406: CN1.S8 24.98,1.09
  Top 0.5: C2.1 v11.75,6.41 | C6.1 R17.2 | 17.44,4.46 arc45 17.61,4.53 | v17.98,4.9 17.9,4.82 arc45 17.83,4.65
  Top 0.7: CN1.S1 CN1.S7 | CN1.S7 CN1.S4 CN1.S5 CN1.S8 CN1.S2 | CN1.S2 24.33,3.33 | CN1.S7 17.88,1.04 16.46,1.04 arc90 v16.45,1.03 v16.45,1.02 16.06,1.02 arc-90 C1.1 | 9.08,9.49 arc45 9.25,9.56 9.63,9.84 9.63,11.09 | v9.63,9.49 C3.1 | 24.28,3.34 arc-45 CN1.S2 | v25.53,1.09 24.98,1.09 24.28,1.09 | v25.53,3.34 24.33,3.34 | IC1.2 17.44,4.46 | 17.61,4.53 v17.98,4.9 | 17.83,4.65 17.83,3.39 | L1.1 24.35,5.88 arc45 24.28,5.7 CN1.S2
  Bottom 0.254: CN1.S8 25.53,1.45 v25.53,1.09 | CN1.S7 16.45,1.45 v16.45,1.02
  Bottom 0.5: v23.03,34.76 22.88,34.84
  pour Bottom: 0.83,19.14 0.83,15.89 2.08,11.89 -0.17,7.39 -0.17,5.89 1.58,3.64 2.58,3.89 5.83,6.39 12.83,-0.36 13.08,-0.61 28.33,-0.61 35.83,5.64 42.33,5.64 45.08,11.39 40.33,12.89 41.33,16.39 41.33,19.14
  pour Bottom: 35.5,19.64 35.48,20.38 35.43,21.11 35.33,21.83 35.21,22.54 35.05,23.24 34.85,23.93 34.63,24.6 34.37,25.25 34.08,25.89 33.76,26.51 33.41,27.11 33.04,27.7 32.64,28.27 32.21,28.81 31.75,29.33 31.28,29.83 30.78,30.31 30.25,30.76 29.71,31.19 29.14,31.59 28.56,31.97 27.95,32.32 27.33,32.64 26.69,32.92 26.04,33.18 25.37,33.41 24.68,33.6 23.99,33.76 23.28,33.89 22.55,33.98 21.82,34.04 21.08,34.06 20.34,34.04 19.61,33.98 18.88,33.89 18.17,33.76 17.48,33.6 16.79,33.41 16.12,33.18 15.47,32.92 14.83,32.64 14.21,32.32 13.6,31.97 13.02,31.59 12.45,31.19 11.91,30.76 11.38,30.31 10.88,29.83 10.41,29.33 9.95,28.81 9.52,28.27 9.12,27.7 8.75,27.11 8.4,26.51 8.08,25.89 7.79,25.25 7.54,24.6 7.31,23.93 7.11,23.24 6.95,22.54 6.83,21.83 6.73,21.11 6.68,20.38 6.66,19.64
  pour Bottom: 33.58,19.64 35.5,19.64 35.5,19.14 33.58,19.14
  pour Bottom: 14.08,19.64 14.08,19.14 6.66,19.14 6.66,19.64
  pour Bottom: 15.58,35.91 26.63,35.91 26.63,32.61 15.83,32.61 arc-90 15.58,32.86
IRQ  (via drill 0.4)
  Top 0.2: IC3.1 20.28,34.39 19.79,34.39
  Top 0.25: 19.79,34.39 19.13,34.39 | R16.1 arc45 18.24,34.39 19.13,34.39 | 19.13,34.39 v19.13,33.63 | 6.83,19.64 arc-67 15.33,32.89 v15.32,33.63 | 6.83,19.64 arc-90 6.84,19.63 | 6.83,19.64 6.83,19.49 arc-45 6.76,19.31 6.58,19.14 2.58,19.14 arc22 4.08,12.39 arc21 4.58,11.64 arc135 5.83,12.14 5.83,12.86 IC2.32
  Bottom 0.25: v19.13,33.63 v15.32,33.63
MISO  (via drill 0.4)
  Top 0.25: 11.48,16.36 IC2.16 11.8,16.36 arc90 12.03,16.59 12.03,17.14 arc90 v11.58,17.59
  Bottom 0.25: CN6.1 3.53,8.74 4.03,8.74 4.11,8.81 arc-45 4.28,8.89 5.73,8.89 arc45 5.9,8.96 6.26,9.31 arc-45 6.43,9.39 7.58,9.39 arc45 7.75,9.46 9.51,11.21 arc45 9.58,11.39 9.58,16.78 arc-45 9.65,16.96 9.76,17.06 arc-45 9.93,17.14 11.13,17.14 arc90 v11.58,17.59
MOSI_PWM4  (via drill 0.4)
  Top 0.25: v13.08,26.39 arc-32 13.48,27.14 arc-18 15.73,28.84 Q2.5 | R7.2 v10.83,26.64 arc2 10.38,26.04 arc50 9.38,20.74 arc67 v11.88,18.54 arc-90 12.48,17.99 12.48,16.54 arc-90 11.8,15.86 IC2.15
  Bottom 0.25: v13.08,26.39 12.68,26.69 arc77 v10.83,26.64 | CN6.4 CN6.4 arc45 3.42,6.79 3.83,6.64 4.28,6.64 arc45 4.45,6.71 5.56,7.81 arc-45 5.73,7.89 6.78,7.89 arc45 6.95,7.96 10.01,11.01 arc45 10.08,11.19 10.08,15.28 arc-45 10.15,15.46 10.51,15.81 arc-45 10.68,15.89 11.93,15.89 arc90 12.48,16.64 12.48,17.94 arc90 v11.88,18.54
N$1  (via drill 0.4 pad 1)
  Top 0.25: R8.1 20.69,29.02 arc-90 v21.08,28.64
  Top 0.7: D4.A arc90 D4.A R8.1
N$2  (via drill 0.4 pad 1)
  Top 0.25: 19.01,5.99 L2.1
  Top 0.5: v20.33,5.99 19.01,5.99 | CN1.P1 19.78,5.21 arc90 L2.1
N$3
  Top 0.25: D1.K 19.73,11.69 arc45 19.8,11.51 20.88,10.44 arc45 21.06,10.36 Q1.3
N$4
  Top 0.4: 22.38,4.58 CN1.P5
  Top 0.5: L1.2 22.45,5.28 arc45 22.38,5.1 CN1.P5
N$5
  Top 0.7: F1.1 16.42,6.72 arc-90 L2.2
N$6
  Top 0.25: C4.1 6.08,9.14 arc70 6.83,8.14 arc4 CN3.1
N$7  (via drill 0.4 pad 1)
  Top 0.25: v21.08,11.64 22.34,11.64 arc90 D1.A
  Top 0.7: D1.A R2.1
N$8  (via drill 0.4 pad 1)
  Top 0.25: D5.A v27.83,23.64
  Top 0.7: D5.A R10.1
N$9  (via drill 0.4 pad 1)
  Top 0.25: R12.1 v29.33,14.89
  Top 0.7: D6.A R12.1
N$10  (via drill 0.4)
  Top 0.25: v16.33,12.84 16.18,12.84 arc45 16.11,12.76 15.58,12.24 15.58,10.64 arc90 16.23,9.99 arc-35 17.33,9.64 arc44 Q1.6
  Top 0.7: D2.K v14.13,15.84
  Bottom 0.7: v14.13,15.84 14.37,15.46 arc23 15.83,13.89 arc-56 v16.33,12.84
N$11  (via drill 0.4 pad 1)
  Top 0.25: R4.1 13.17,13.31 arc45 12.88,12.6 v12.88,12.44
  Top 0.7: R4.1 D2.A
N$12  (via drill 0.4 pad 1)
  Top 0.25: D3.A 13.79,22.65 arc86 v13.83,23.89
  Top 0.7: R6.1 D3.A
N$13
  Top 0.3: 15.12,27.69 arc-16 Q2.6
  Top 0.5: 14.69,24.87 arc-116 14.43,27.15 arc0 15.12,27.69
  Top 0.7: D3.K 14.69,24.87
N$14  (via drill 0.4)
  Top 0.3: v18.45,27.53 arc28 Q2.3
  Top 0.7: D4.K v21.07,27.54
  Bottom 0.7: v21.07,27.54 20.44,27.54 arc6 v18.45,27.53
N$15
  Top 0.3: 31.01,20.8 Q3.6 arc-90 Q3.6
  Top 0.7: D5.K 29.77,22.42 arc-90 31.01,21.19 31.01,20.8
N$16  (via drill 0.4)
  Top 0.3: v28.83,18.18 28.83,18.41 arc-90 Q3.3
  Top 0.7: D6.K v27.93,15.68 | v28.83,18.18 28.85,18.18
  Bottom 0.7: v27.93,15.68 arc21 v28.83,18.18
PWM1  (via drill 0.4)
  Top 0.25: IC2.13 12.26,14.86 arc-45 12.44,14.78 12.58,14.64 13.23,14.64 arc45 13.4,14.71 v13.58,14.89 | R1.2 14.98,11.89 arc-10 v15.33,13.09 arc-144 17.83,12.28 17.83,10.64 arc67 18.33,9.89 arc31 Q1.5
  Bottom 0.25: v13.58,14.89 13.93,14.49 arc11 14.83,13.64 arc-20 v15.33,13.09
PWM2  (via drill 0.4)
  Top 0.25: R3.2 v17.18,10.64 | IC2.10 12.14,13.36 arc-45 v12.38,13.34 | v22.38,9.14 22,9.52 arc45 21.83,9.59 21.49,9.59 arc-90 Q1.2
  Bottom 0.25: v12.38,13.34 13.53,13.34 arc-45 13.7,13.26 15.26,11.71 arc45 15.43,11.64 17.33,11.64 | 17.33,11.64 19.83,11.64 22.3,9.17 arc45 v22.38,9.14 | v17.18,10.64 17.18,11.49 arc-90 17.33,11.64
PWM3  (via drill 0.4)
  Top 0.25: v13.68,29.64 R5.2 | IC2.14 12.75,15.36 arc45 v12.83,15.39
  Top 0.3: Q2.2 17.18,26.4 arc-83 17.11,26.09 arc-11 16.38,25.65 arc-92 v15.6,25.94
  Bottom 0.25: 15.58,25.89 arc244 v15.6,25.94 | v13.68,29.64 15.83,26.89 arc-103 v15.6,25.94 | v15.6,25.94 arc-114 15.83,24.89 arc57 13.83,18.14 arc11 14.28,16.74 arc16 13.18,15.79 v12.83,15.39
PWM5  (via drill 0.4)
  Top 0.25: R9.2 arc148 33.43,20.97 v33.43,20.09 arc-62 35.08,17.99 arc-2 35.18,17.04 arc-92 33.51,15.11 arc63 32.83,14.64 arc-93 15.08,8.39 arc38 13.33,8.64 arc-22 8.08,8.64 arc-100 7.58,9.14 arc50 7.01,10.71 6.95,10.76 arc-45 6.88,10.94 6.88,11.38 arc-45 6.95,11.56 7.01,11.61 arc45 7.08,11.79 7.08,12.24 7.09,12.24 IC2.1
  Top 0.3: Q3.2 28.94,19.63 arc-90 28.47,20.11 28.47,20.76 arc-90 v28.8,21.09
  Bottom 0.25: v33.43,20.09 29.8,20.09 arc-90 v28.8,21.09
PWM6  (via drill 0.4)
  Top 0.25: v33.43,19.19 33.43,18.27 arc17 R11.2 arc-66 34.58,17.39 arc-100 33.59,15.68 arc56 32.25,14.63 arc-111 12.62,10.93 arc-42 12.08,12.14 12.08,12.64 arc90 11.86,12.86 IC2.9 11.51,12.86 | v29.82,18.14 arc-45 v29.83,18.14
  Top 0.3: Q3.5 30.56,19.63 arc90 30.21,19.28 30.21,18.57 arc-90 v29.82,18.14
  Bottom 0.25: v33.43,19.19 30.88,19.19 arc90 v29.83,18.14
RESET  (via drill 0.4)
  Top 0.25: v4.03,14.24 arc-45 4.15,14.36 IC2.29 | C4.2 v5.08,10.78 v5.08,10.79 | R13.2 4.38,16.14 arc90 v4.48,16.04
  Bottom 0.25: 2.64,11.24 3.23,12.29 arc14 v4.03,14.24 4.03,15.59 arc-90 v4.48,16.04 | 2.64,11.24 2.43,10.86 0.87,8.1 arc73 0.91,7.8 CN6.5 | v5.08,10.79 4.93,10.79 arc-23 2.64,11.24
REXT
  Top 0.2: IC3.7 23.58,36.24 23.6,36.24 arc-90 23.86,35.98 R17.1
RXD
  Top 0.25: CN4.1 5.08,13.78 arc-45 5.25,13.86 IC2.30
SCK  (via drill 0.4)
  Top 0.25: IC2.17 10.59,17.78 arc90 9.83,18.54 v9.38,18.54
  Bottom 0.25: CN6.3 2.4,8.08 arc-45 2.33,8.25 2.33,9.03 arc-45 2.4,9.21 3.01,9.81 arc-45 3.18,9.89 3.73,9.89 arc-45 3.9,9.81 4.26,9.46 arc45 4.43,9.39 5.48,9.39 arc45 5.65,9.46 6.01,9.81 arc-45 6.18,9.89 7.38,9.89 arc45 7.55,9.96 9.01,11.41 arc45 9.08,11.59 9.08,17.28 arc-27 v9.38,18.54
SCL
  Top 0.2: IC3.2 20.68,34.26 arc-45 20.61,34.09
  Top 0.25: 20.61,34.09 19.46,32.94 arc-45 19.28,32.87 18.48,32.87 arc-45 18.33,32.93 R15.1 18.1,32.47 arc-45 18.03,32.29 17.95,32.21 arc-45 17.78,32.14 15.08,32.14 arc66 7.33,19.64 7.33,19.24 arc-45 7.26,19.06 6.83,18.64 3.08,18.64 arc12 3.68,14.94 3.69,14.93 arc45 3.87,14.86 IC2.28
SDA
  Top 0.2: IC3.4 21.48,33.93 | 21.01,33.72 arc45 21.08,33.9 IC3.3 21.08,33.93 21.48,33.93 | 21.48,33.93 arc45 21.55,33.75
  Top 0.25: R14.1 23.93,33.12 arc-90 23.68,32.87 22.54,32.87 arc-45 22.36,32.94 21.55,33.75 | 21.01,33.72 19.74,32.46 arc-45 19.57,32.39 19.08,32.39 18.4,31.71 arc-45 18.23,31.64 15.33,31.64 arc65 7.83,19.64 7.83,18.99 arc-45 7.76,18.81 7.08,18.14 3.58,18.14 arc9 4.03,15.39 arc45 4.11,15.36 IC2.27
TEST
  Top 0.25: IC2.8 10.59,11.38 arc90 CN2.1
TXD
  Top 0.25: IC2.31 5.72,13.36 arc45 5.68,13.34 5.68,13.34 arc6 5.68,13.34 5.28,12.84 arc19 CN5.1
VREG
  Top 0.2: IC3.5 21.88,34.34 arc90 22.13,34.09
  Top 0.25: 22.13,34.09 24.06,34.09 C6.2

### Text on the board
tNames: F1